# EAGLE design AVRUSB500rl (EAGLE 6.1)
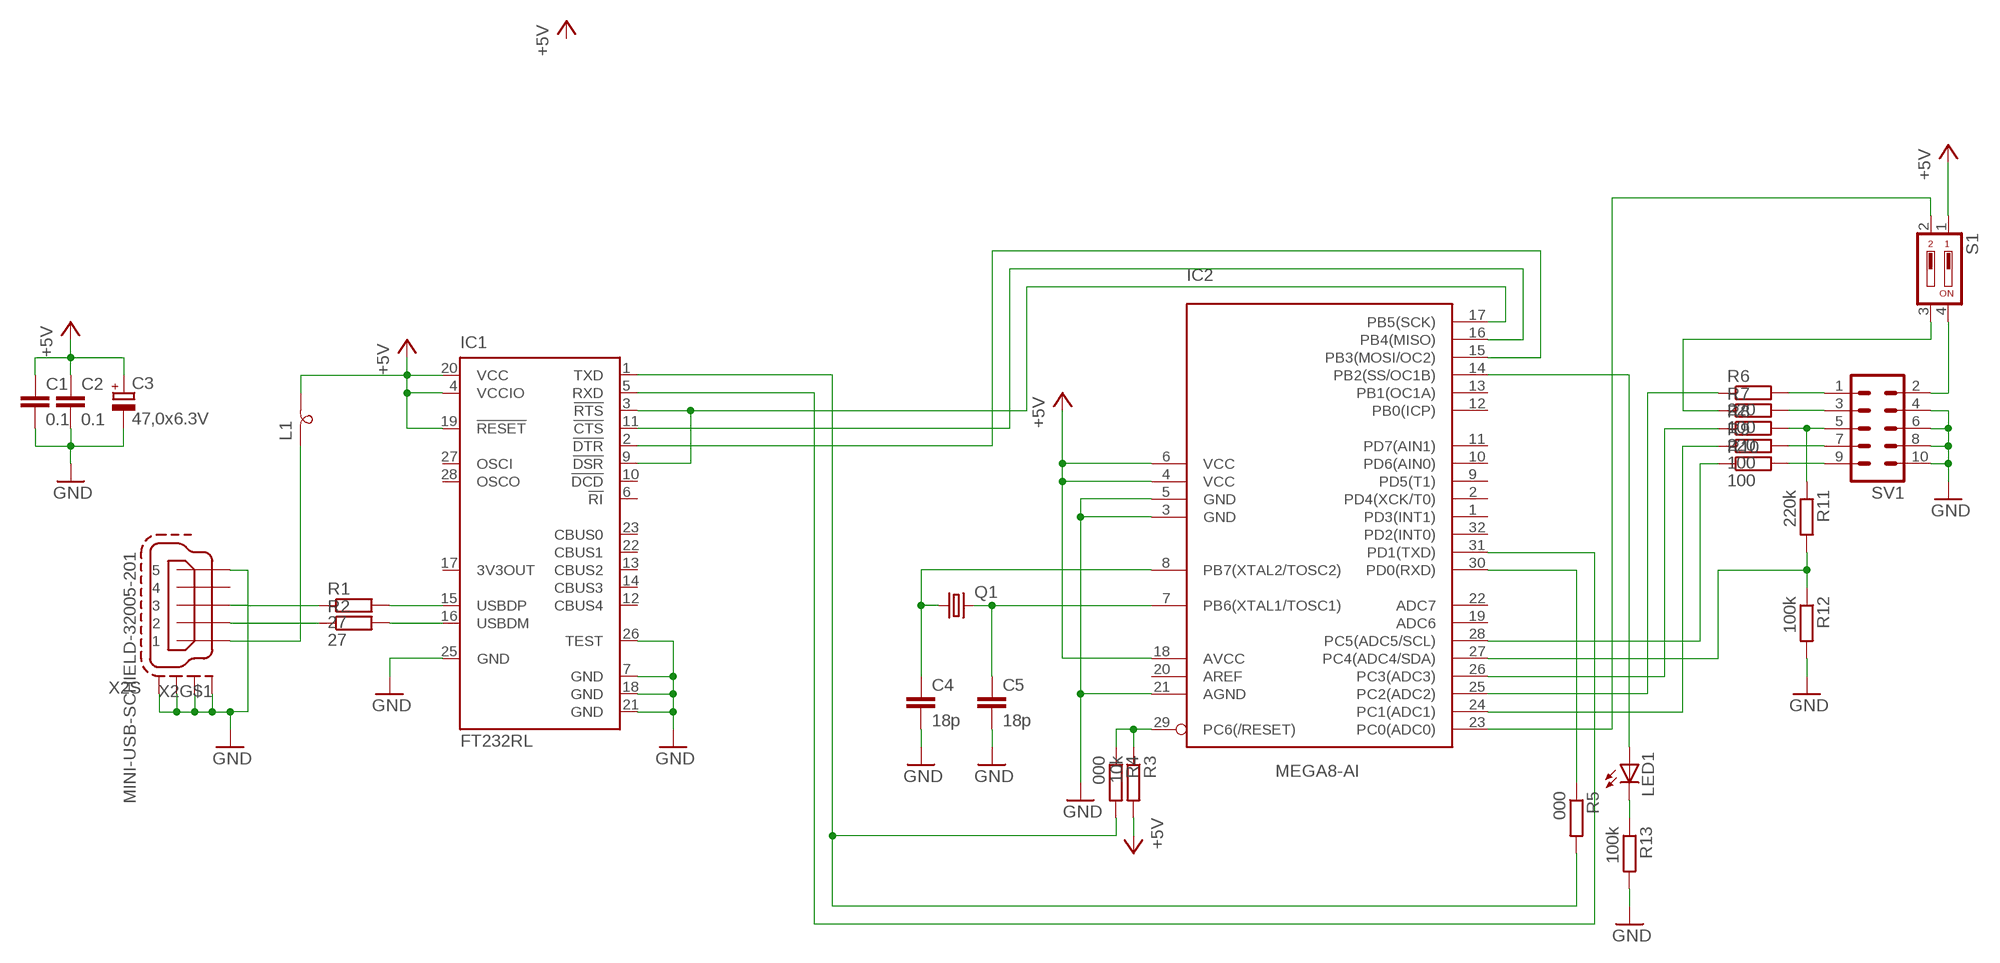
[diagram p0: schematic, sheet 1]

## Parts
C1  0.1  C-EUC0805  [C0805]
C2  0.1  C-EUC0805  [C0805]
C3  47,0x6.3V  CPOL-EU153CLV-0605  [153CLV-0605]
C4  18p  C-EUC0805  [C0805]
C5  18p  C-EUC0805  [C0805]
IC1  FT232RL  [SSOP28]
IC2  MEGA8-AI  [TQFP32-08]
L1  SM-B5  [SM-B5]
LED1  LED3MM  [LED3MM]
Q1  CRYSTALHC49UP  [HC49UP]
R1  27  R-EU_R0805  [R0805]
R2  27  R-EU_R0805  [R0805]
R3  10k  R-EU_R0805  [R0805]
R4  000  R-EU_R0805  [R0805]
R5  000  R-EU_R0805  [R0805]
R6  220  R-EU_R0805  [R0805]
R7  100  R-EU_R0805  [R0805]
R8  220  R-EU_R0805  [R0805]
R9  100  R-EU_R0805  [R0805]
R10  100  R-EU_R0805  [R0805]
R11  220k  R-EU_R0805  [R0805]
R12  100k  R-EU_R0805  [R0805]
R13  100k  R-EU_R0805  [R0805]
S1  DA02  [DA-02]
SV1  ML10L  [ML10L]
X2  MINI-USB-SCHIELD-32005-201  [32005-201]

## Nets
+5V: C1.1 C2.1 C3.+ IC2.4(VCC) IC2.6(VCC) IC2.18(AVCC) R3.2 S1.1
GND: C1.2 C2.2 C3.- C4.2 C5.2 IC1.7(GND) IC1.18(GND) IC1.21(GND) IC1.25(GND) IC1.26(TEST) IC2.3(GND) IC2.5(GND) IC2.21(AGND) R12.2 R13.2 SV1.4 SV1.6 SV1.8 SV1.10 X2.5 X2.M1(S:S1) X2.M2(S:S2) X2.M3(S:S3) X2.M4(S:S4)
N$1: R1.1 X2.3
N$2: IC1.15(USBDP) R1.2
N$3: R2.1 X2.2
N$4: IC1.16(USBDM) R2.2
N$5: R6.2 SV1.1
N$6: C4.1 IC2.8(PB7(XTAL2/TOSC2)) Q1.1
N$7: C5.1 IC2.7(PB6(XTAL1/TOSC1)) Q1.2
N$8: IC2.29(PC6(/RESET)) R3.1 R4.1
N$9: IC1.1(TXD) R4.2 R5.2
N$10: IC2.30(PD0(RXD)) R5.1
N$11: R7.2 SV1.3
N$12: IC1.5(RXD) IC2.31(PD1(TXD))
N$13: IC1.3(!RTS) IC1.9(!DSR) IC2.17(PB5(SCK))
N$14: IC1.11(!CTS) IC2.16(PB4(MISO))
N$15: IC1.2(!DTR) IC2.15(PB3(MOSI/OC2))
N$16: R8.2 R11.1 SV1.5
N$17: R9.2 SV1.7
N$18: R10.2 SV1.9
N$19: IC2.27(PC4(ADC4/SDA)) R11.2 R12.1
N$20: IC2.28(PC5(ADC5/SCL)) R10.1
N$21: R7.1 S1.3
N$22: L1.1 X2.1
N$23: IC2.24(PC1(ADC1)) R9.1
N$24: IC2.26(PC3(ADC3)) R8.1
N$25: IC2.25(PC2(ADC2)) R6.1
N$26: S1.4 SV1.2
N$27: IC2.23(PC0(ADC0)) S1.2
N$28: IC2.14(PB2(SS/OC1B)) LED1.A
N$29: LED1.K(C) R13.1
VCC: IC1.4(VCCIO) IC1.19(!RESET) IC1.20(VCC) L1.2 ; supply symbol labelled +5V
Unconnected: IC1.6(!RI) IC1.10(!DCD) IC1.12(CBUS4) IC1.13(CBUS2) IC1.14(CBUS3) IC1.17(3V3OUT) IC1.22(CBUS1) IC1.23(CBUS0) IC1.27(OSCI) IC1.28(OSCO) IC2.1(PD3(INT1)) IC2.2(PD4(XCK/T0)) IC2.9(PD5(T1)) IC2.10(PD6(AIN0)) IC2.11(PD7(AIN1)) IC2.12(PB0(ICP)) IC2.13(PB1(OC1A)) IC2.19(ADC6) IC2.20(AREF) IC2.22(ADC7) IC2.32(PD2(INT0)) X2.4

## Library data of the parts
C1 C2 C4 C5 = rcl:C-EU: CAPACITOR, European symbol
C3 = rcl:CPOL-EU: POLARIZED CAPACITOR, European symbol
IC1 = ftdichip:FT232R: Source: http://www.ftdichip.com/Documents/DataSheets/DS_FT232R_v104.pdf; MPN: FT232RL; OC_FARNELL: 1146032; OC_NEWARK: 91K9918
IC2 = avr-6:MEGA8: MICROCONTROLLER 8 Kbytes FLASH 1 kbytes SRAM 512 bytes EEPROM USART 6-channel 10 bit ADC 2-channel 8 bit ADC
L1 = inductor-neosid:SM-B: INDUCTOR SMD Bead inductor; OC_FARNELL: unknown; OC_NEWARK: unknown
LED1 = led:LED: LED OSRAM: - CHIPLED LG R971, LG N971, LY N971, LG Q971, LY Q971, LO R971, LY R971 LH N974, LH R974 LS Q976, LO Q976, LY Q976 LO Q996 - Hyper CHIPLED LW Q18S LB Q993, LB Q99A, LB R99A - SideLED LS A670, LO A670, LY A670, LG A670, LP A670 LB A673, LV A673, LT A673, LW A673 LH A674 LY A675 LS A676, LA A676, LO A676, LY A676, LW A676 LS A679, LY A679, LG A679 - Hyper Micro SIDELED® LS Y876, LA Y876, LO Y876, LY Y876 LT Y87S - SmartLED LW L88C, LW L88S LB L89C, LB L89S, LG L890 LS L89K, LO L89K, LY L89K LS L896, LA L896, LO L896, LY L896 - TOPLED LS T670, LO T670, LY T670, LG T670, LP T670 LSG T670, LSP T670, LSY T670, LOP T670, LYG T670 LG T671, LOG T671, LSG T671 LB T673, LV T673, LT T673, LW T673 LH T674 LS T676, LA T676, LO T676, LY T676, LB T676, LH T676, LSB T676, LW T676 LB T67C, LV T67C, LT T67C, LS T67K, LO T67K, LY T67K, LW E67C LS E67B, LA E67B, LO E67B, LY E67B, LB E67C, LV E67C, LT E67C LW T67C LS T679, LY T679, LG T679 LS T770, LO T770, LY T770, LG T770, LP T770 LB T773, LV T773, LT T773, LW T773 LH T774 LS E675, LA E675, LY E675, LS T675 LS T776, LA T776, LO T776, LY T776, LB T776 LHGB T686 LT T68C, LB T68C - Hyper Mini TOPLED® LB M676 - Mini TOPLED Santana® LG M470 LS M47K, LO M47K, LY M47K Source: http://www.osram.convergy.de LUXEON: - LUMILED® LXK2-PW12-R00, LXK2-PW12-S00, LXK2-PW14-U00, LXK2-PW14-V00 LXK2-PM12-R00, LXK2-PM12-S00, LXK2-PM14-U00 LXK2-PE12-Q00, LXK2-PE12-R00, LXK2-PE12-S00, LXK2-PE14-T00, LXK2-PE14-U00 LXK2-PB12-K00, LXK2-PB12-L00, LXK2-PB12-M00, LXK2-PB14-N00, LXK2-PB14-P00, LXK2-PB14-Q00 LXK2-PR12-L00, LXK2-PR12-M00, LXK2-PR14-Q00, LXK2-PR14-R00 LXK2-PD12-Q00, LXK2-PD12-R00, LXK2-PD12-S00 LXK2-PH12-R00, LXK2-PH12-S00 LXK2-PL12-P00, LXK2-PL12-Q00, LXK2-PL12-R00 Source: www.luxeon.com KINGBRIGHT: KA-3528ASYC Source: www.kingbright.com
Q1 = crystal:CRYSTAL: CRYSTAL; OC_FARNELL: unknown; OC_NEWARK: unknown
R1-R13 = resistor:R-EU_: RESISTOR, European symbol
S1 = switch-dil:DA02: DIL/CODE SWITCH; OC_FARNELL: 1255229; OC_NEWARK: unknown
SV1 = con-harting-ml:ML10: HARTING; OC_FARNELL: unknown; OC_NEWARK: unknown
X2 = con-cypressindustries:MINI-USB-SCHIELD-: MINI USB-B Conector Source: www.cypressindustries.com; OC_FARNELL: unknown; OC_NEWARK: unknown

## Board
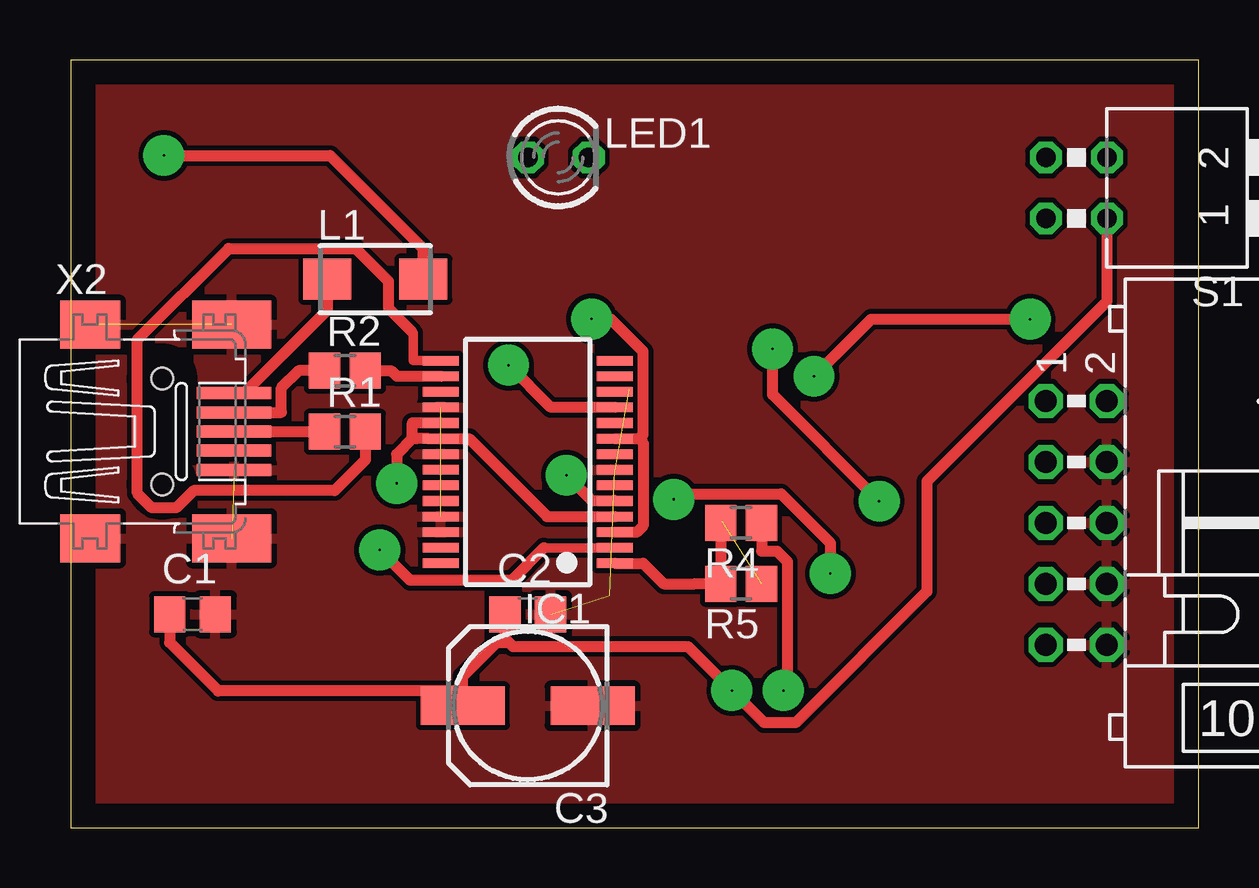
[diagram p1: board, top side]
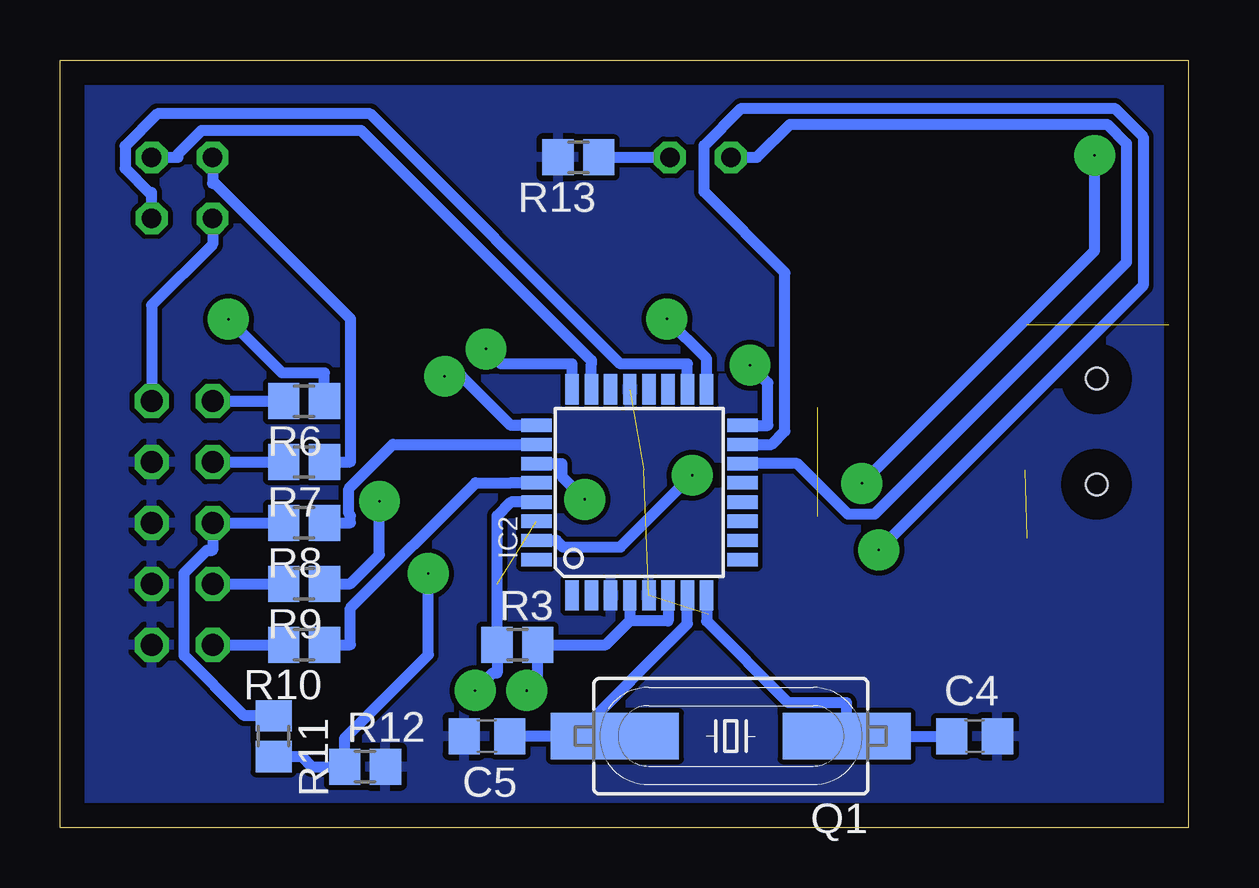
[diagram p2: board, bottom side, seen from below]

Size 47 x 32 mm. Coordinates in mm from the lower left corner, seen from the top.
Outline: 0,0 47,0 47,32 0,32 0,0
Copper layers (1*16): Top 0.035mm / dielectric 1.5mm / Bottom 0.035mm
Design rules: minimum track width 10mil, minimum drill 24mil, track to track 8mil, track to pad 8mil, pad to pad 8mil, via to via 8mil, smd to smd 8mil, copper to edge 40mil, drill to drill 8mil, minimum pad ring 10mil, minimum via ring 8mil, stop-mask expansion 4mil, vias tented up to drill 0mil, thermal gap 10mil

### Footprints (pad centres in the part's own frame; a part is rotated, then mirrored left to right if it is on the bottom)
C0805 = smd 1.3 x 1.5: 1 -0.95,0; 2 0.95,0
153CLV-0605 = smd 3.5 x 1.6: + 2.7,0; - -2.7,0
SSOP28 = smd 0.4 x 1.5: 1 -4.225,-3.625; 2 -3.575,-3.625; 3 -2.925,-3.625; 4 -2.275,-3.625; 5 -1.625,-3.625; 6 -0.975,-3.625; 7 -0.325,-3.625; 8 0.325,-3.625; 9 0.975,-3.625; 10 1.625,-3.625; 11 2.275,-3.625; 12 2.925,-3.625; 13 3.575,-3.625; 14 4.225,-3.625; 15 4.225,3.625; 16 3.575,3.625; 17 2.925,3.625; 18 2.275,3.625; 19 1.625,3.625; 20 0.975,3.625; 21 0.325,3.625; 22 -0.325,3.625; 23 -0.975,3.625; 24 -1.625,3.625; 25 -2.275,3.625; 26 -2.925,3.625; 27 -3.575,3.625; 28 -4.225,3.625
TQFP32-08 = smd 1.27 x 0.559: 1 -4.293,2.8; 2 -4.293,2; 3 -4.293,1.2; 4 -4.293,0.4; 5 -4.293,-0.4; 6 -4.293,-1.2; 7 -4.293,-2; 8 -4.293,-2.8; 17 4.293,-2.8; 18 4.293,-2; 19 4.293,-1.2; 20 4.293,-0.4; 21 4.293,0.4; 22 4.293,1.2; 23 4.293,2; 24 4.293,2.8 | smd 0.559 x 1.27: 9 -2.8,-4.293; 10 -2,-4.293; 11 -1.2,-4.293; 12 -0.4,-4.293; 13 0.4,-4.293; 14 1.2,-4.293; 15 2,-4.293; 16 2.8,-4.293; 25 2.8,4.293; 26 2,4.293; 27 1.2,4.293; 28 0.4,4.293; 29 -0.4,4.293; 30 -1.2,4.293; 31 -2,4.293; 32 -2.8,4.293
SM-B5 = smd 2 x 1.7: 1 -2,0; 2 2,0
LED3MM = drill 0.813 octagon: A -1.27,0; K 1.27,0
HC49UP = smd 5.334 x 1.93: 1 -4.826,0; 2 4.826,0
R0805 = smd 1.3 x 1.5: 1 -0.85,0; 2 0.85,0
DA-02 = drill 0.813 octagon: 1 -1.27,-1.27; 2 1.27,-1.27; 3 1.27,1.27; 4 -1.27,1.27
ML10L = drill 0.914 octagon: 1 -5.08,-1.27; 2 -5.08,1.27; 3 -2.54,-1.27; 4 -2.54,1.27; 5 0,-1.27; 6 0,1.27; 7 2.54,-1.27; 8 2.54,1.27; 9 5.08,-1.27; 10 5.08,1.27
32005-201 = smd 3.1 x 0.5: 1 3,1.6; 2 3,0.8; 3 3,0; 4 3,-0.8; 5 3,-1.6 | smd 2.5 x 2: M1 -3,-4.45; M2 -3,4.45 | smd 3.3 x 2: M3 2.9,4.45; M4 2.9,-4.45 | hole 0.9: 0,2.2; 0,-2.2

### Placement (x,y rotation side)
C1  5.08,8.89 0 top
C2  19.05,8.89 0 top
C3  19.05,5.08 180 top
C4  8.89,3.81 0 bottom
C5  29.21,3.81 180 bottom
IC1  19.05,15.24 90 top
IC2  22.86,13.97 90 bottom
L1  12.7,22.86 0 top
LED1  20.32,27.94 0 top
Q1  19.05,3.81 180 bottom
R1  11.43,16.51 0 top
R2  11.43,19.05 0 top
R3  27.94,7.62 0 bottom
R4  27.94,12.7 180 top
R5  27.94,10.16 180 top
R6  36.83,17.78 180 bottom
R7  36.83,15.24 180 bottom
R8  36.83,12.7 180 bottom
R9  36.83,10.16 180 bottom
R10  36.83,7.62 180 bottom
R11  38.1,3.81 270 bottom
R12  34.29,2.54 0 bottom
R13  25.4,27.94 180 bottom
S1  41.91,26.67 90 top
SV1  41.91,12.7 270 top
X2  3.81,16.51 0 top

### Tracks (layer width: path | path; a pad name or v marks a point on that pad's centre or on a via)
+5V  (via drill 0.1 pad 1.7)
  Top 0.45: S1.1 43.18,21.93 35.68,14.44 35.68,9.84 30.21,4.37 28.9,4.37 v27.55,5.71 25.72,7.55 18.43,7.55 18.1,7.88 | 18.1,7.88 18.1,7.71 17.75,7.71 16.35,6.31 16.35,5.69 | 18.1,7.88 18.1,8.74 C2.1 | C1.1 4.13,7.71 6.15,5.69 16.35,5.69 | C3.+ 16.35,5.69
  Bottom 0.45: v27.55,5.71 27.09,6.18 R3.2 24.25,7.62 23.26,8.61 | 23.26,8.61 21.66,8.61 IC2.6 | S1.1 43.18,26.49 43.29,26.49 44.28,27.48 44.28,28.41 42.94,29.76 34.08,29.76 23.65,19.33 20.86,19.33 IC2.18 | IC2.4 23.26,8.61
GND  (7 unrouted)
  pour Bottom: 0,0 46.99,0 46.99,31.75 0,31.75
  pour Top: 0,0 0,31.75 46.99,31.75 46.99,30.48 46.99,0
N$1
  Top 0.45: X2.3 R1.1
N$2
  Top 0.4: IC1.15 14.27,19.46 14.27,20.62 14.2,20.69
  Top 0.45: 14.2,20.69 13.24,21.65 13.24,22.77 11.88,24.14 6.58,24.14 2.79,20.34 2.79,13.93 3.39,13.32 4.4,13.32 5.13,14.05 11,14.05 12.28,15.33 R1.2
N$3
  Top 0.45: X2.2 8.79,17.31 8.79,18.34 9.5,19.05 R2.1
N$4
  Top 0.45: R2.2 13.36,19.05 13.59,18.82 IC1.16
N$5
  Bottom 0.45: SV1.1 R6.2
N$6
  Bottom 0.45: IC2.8 20.06,8.61 16.65,5.2 14.22,5.2 Q1.1 C4.1
N$7
  Bottom 0.45: 25.74,3.81 25.54,3.81 20.86,8.49 IC2.7 | 25.74,3.81 C5.1 | Q1.2 25.74,3.81
N$8  (via drill 0.1 pad 1.7)
  Top 0.45: v29.7,5.71 29.87,5.88 29.87,11.09 29.43,11.52 28.79,11.52 28.79,12.27 R4.1
  Bottom 0.45: IC2.29 28.22,13.57 28.79,13 R3.1 28.79,7.03 28.79,6.44 28.97,6.44 v29.7,5.71
N$9
  Top 0.45: R4.2 R5.2 26.01,10.16 24.71,10.16 23.85,11.02 IC1.1
N$10  (1 unrouted)
N$11
  Bottom 0.45: SV1.3 R7.2
N$12  (via drill 0.1 pad 1.7)
  Top 0.4: 22.65,13.64 IC1.5
  Top 0.45: v20.66,14.69 21.71,13.64 22.65,13.64
  Bottom 0.45: IC2.31 26.32,11.97 26.04,11.69 23.66,11.69 v20.66,14.69
N$13  (via drill 0.1 pad 1.7)
  Top 0.4: IC1.3
  Top 0.45: 23.69,16.21 23.85,16.05 23.85,12.58 23.58,12.31 IC1.3 | 23.69,16.21 23.85,16.38 23.85,19.85 22.51,21.2 v21.71,21.2 | IC1.9 23.69,16.21
  Bottom 0.45: IC2.17 20.06,19.55 v21.71,21.2
N$14  (via drill 0.1 pad 1.7)
  Top 0.45: IC1.11 20.01,17.52 v18.25,19.28
  Bottom 0.45: v18.25,19.28 17.5,18.53 17.5,16.77 IC2.16
N$15  (via drill 0.1 pad 1.7)
  Top 0.4: 19.73,11.66 IC1.2
  Top 0.45: 19.73,11.66 18.37,10.31 14.14,10.31 v12.88,11.57
  Bottom 0.45: IC2.15 17.35,15.97 16.79,16.53 16.79,23.14 20.16,26.5 20.16,28.43 18.61,29.98 3.06,29.98 1.87,28.79 1.87,22.59 v12.88,11.57
N$16
  Bottom 0.45: R11.1 39.32,4.66 41.83,7.17 41.83,10.61 40.88,11.56 40.64,11.56 SV1.5 R8.2
N$17
  Bottom 0.45: SV1.7 R9.2
N$18
  Bottom 0.45: SV1.9 R10.2
N$19  (via drill 0.1 pad 1.7)
  Top 0.45: v25.13,13.68 25.37,13.91 29.6,13.91 31.66,11.86 v31.66,10.59
  Bottom 0.45: v31.66,10.59 31.66,7.2 35.14,3.72 R12.1 36.5,2.54 36.92,2.96 R11.2 | IC2.27 26.09,15.17 26.09,14.64 v25.13,13.68
N$20
  Bottom 0.45: IC2.28 28.22,14.37 29.69,14.37 34.9,9.15 34.9,7.62 R10.1
N$21
  Bottom 0.45: R7.1 34.9,15.24 34.9,21.22 40.54,26.85 40.64,26.85 S1.3
N$22
  Top 0.45: L1.1 10.7,21.58 7.23,18.11 X2.1
N$23  (via drill 0.1 pad 1.7)
  Top 0.45: v33.69,13.6 29.25,18.04 v29.25,19.95
  Bottom 0.45: v33.69,13.6 33.69,11.37 34.9,10.16 R9.1 | IC2.24 25.66,19.33 28.62,19.33 v29.25,19.95
N$24
  Bottom 0.45: IC2.26 33.13,15.97 34.97,14.13 34.97,13.07 34.9,13.01 34.9,12.7 R8.1
N$25  (via drill 0.1 pad 1.7)
  Top 0.45: v30.97,18.81 33.36,21.2 v39.98,21.2
  Bottom 0.45: R6.1 35.98,18.96 37.75,18.96 v39.98,21.2 | IC2.25 28.22,16.77 30.26,18.81 v30.97,18.81
N$26
  Bottom 0.45: SV1.2 43.18,21.77 40.64,24.31 S1.4
N$27
  Bottom 0.45: IC2.23 24.86,19.33 24.86,19.47 34.46,29.07 41.09,29.07 42.09,28.08 42.09,27.94 S1.2
N$28
  Bottom 0.45: LED1.A 17.96,27.94 16.58,29.32 3.37,29.32 2.56,28.51 2.56,23.56 13.06,13.06 14.16,13.06 16.27,15.17 IC2.14
N$29
  Bottom 0.45: R13.1 LED1.K
VCC  (via drill 0.1 pad 1.7)
  Top 0.45: IC1.4 19.85,12.96 16.6,16.21 IC1.20 14.92,16.21 14.41,16.21 14.25,16.21 | L1.2 14.7,24.14 10.82,28.02 v3.89,28.02 | 14.25,16.21 13.59,15.56 v13.59,14.35 | IC1.19 14.25,16.86 14.25,16.21
  Bottom 0.45: v13.59,14.35 3.89,24.05 v3.89,28.02